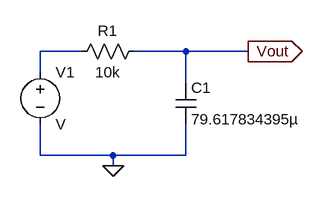
[diagram p0: schematic p1.asc]
p1.asc, the LTspice schematic file:
Version 4
SHEET 1 880 680
WIRE 128 96 64 96
WIRE 288 96 208 96
WIRE 384 96 288 96
WIRE 64 128 64 96
WIRE 288 144 288 96
WIRE 64 256 64 208
WIRE 176 256 64 256
WIRE 288 256 288 208
WIRE 288 256 176 256
WIRE 176 272 176 256
FLAG 176 272 0
FLAG 384 96 Vout
IOPIN 384 96 Out
SYMBOL cap 272 144 R0
SYMATTR InstName C1
SYMATTR Value 79.617834395µ
SYMBOL res 224 80 R90
WINDOW 0 0 56 VBottom 2
WINDOW 3 32 56 VTop 2
SYMATTR InstName R1
SYMATTR Value 10k
SYMBOL voltage 64 112 R0
SYMATTR InstName V1

The netlist it stands for:
* p1.asc
C1 Vout 0 79.617834395µ
R1 Vout N001 10k
V1 N001 0 V
.backanno
.end